# EAGLE design light (EAGLE 8.0.2)
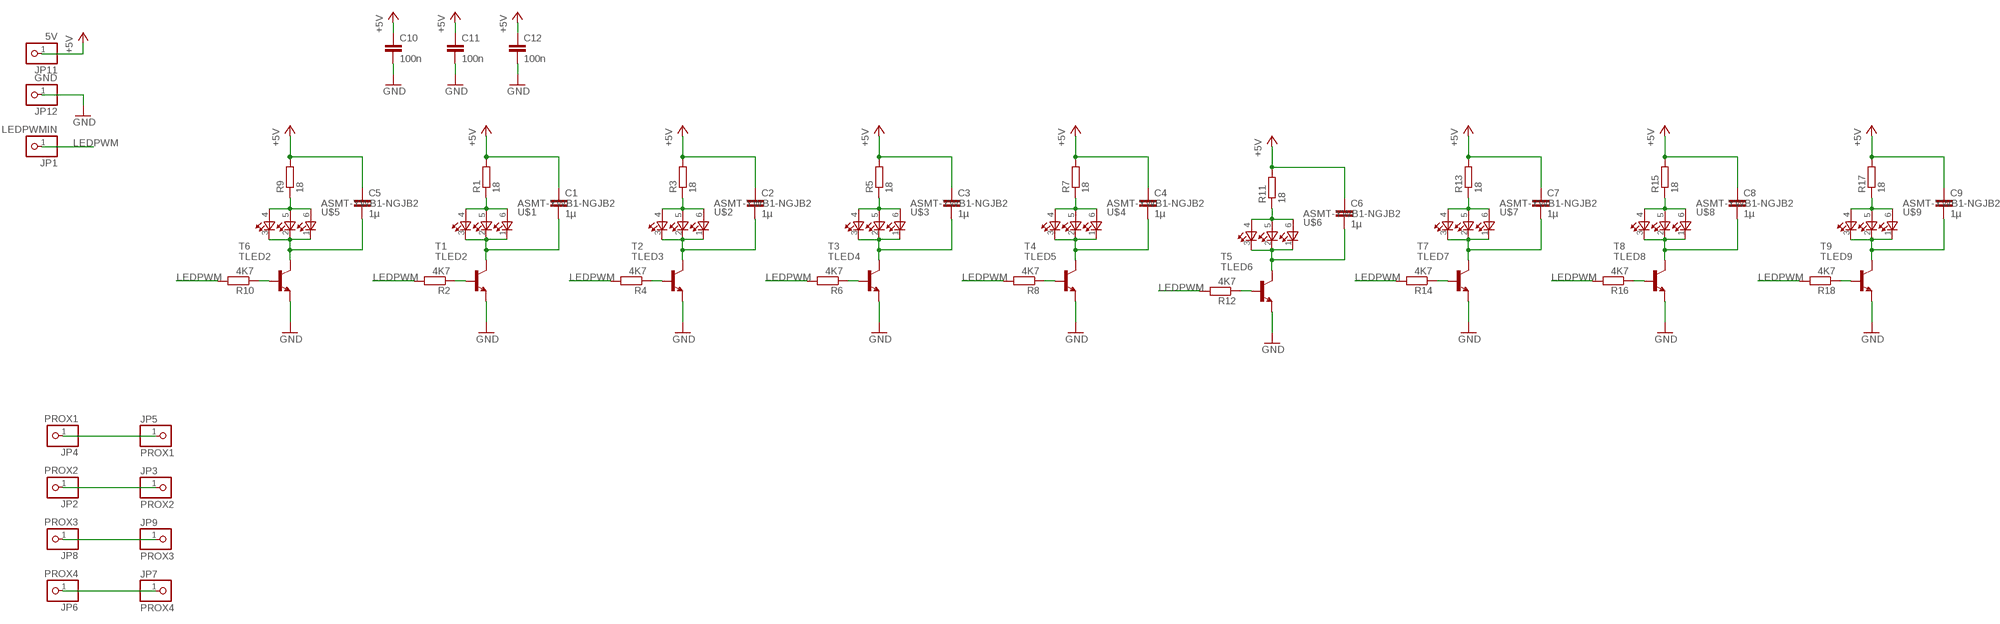
[diagram p0: schematic, sheet 1]

## Parts
C1  1µ  C-EUC0805  [C0805]
C2  1µ  C-EUC0805  [C0805]
C3  1µ  C-EUC0805  [C0805]
C4  1µ  C-EUC0805  [C0805]
C5  1µ  C-EUC0805  [C0805]
C6  1µ  C-EUC0805  [C0805]
C7  1µ  C-EUC0805  [C0805]
C8  1µ  C-EUC0805  [C0805]
C9  1µ  C-EUC0805  [C0805]
C10  100n  C-EUC0805  [C0805]
C11  100n  C-EUC0805  [C0805]
C12  100n  C-EUC0805  [C0805]
JP1  LEDPWMIN  PINHD-1X1  [1X01]
JP2  PROX2  PINHD-1X1  [1X01]
JP3  PROX2  PINHD-1X1  [1X01]
JP4  PROX1  PINHD-1X1  [1X01]
JP5  PROX1  PINHD-1X1  [1X01]
JP6  PROX4  PINHD-1X1  [1X01]
JP7  PROX4  PINHD-1X1  [1X01]
JP8  PROX3  PINHD-1X1  [1X01]
JP9  PROX3  PINHD-1X1  [1X01]
JP11  5V  PINHD-1X1  [1X01]
JP12  GND  PINHD-1X1  [1X01]
R1  18  R-EU_R0805  [R0805]
R2  4K7  R-EU_R0805  [R0805]
R3  18  R-EU_R0805  [R0805]
R4  4K7  R-EU_R0805  [R0805]
R5  18  R-EU_R0805  [R0805]
R6  4K7  R-EU_R0805  [R0805]
R7  18  R-EU_R0805  [R0805]
R8  4K7  R-EU_R0805  [R0805]
R9  18  R-EU_R0805  [R0805]
R10  4K7  R-EU_R0805  [R0805]
R11  18  R-EU_R0805  [R0805]
R12  4K7  R-EU_R0805  [R0805]
R13  18  R-EU_R0805  [R0805]
R14  4K7  R-EU_R0805  [R0805]
R15  18  R-EU_R0805  [R0805]
R16  4K7  R-EU_R0805  [R0805]
R17  18  R-EU_R0805  [R0805]
R18  4K7  R-EU_R0805  [R0805]
T1  TLED2  MMBT3904LT1-NPN-SOT23-BEC  [SOT23-BEC]
T2  TLED3  MMBT3904LT1-NPN-SOT23-BEC  [SOT23-BEC]
T3  TLED4  MMBT3904LT1-NPN-SOT23-BEC  [SOT23-BEC]
T4  TLED5  MMBT3904LT1-NPN-SOT23-BEC  [SOT23-BEC]
T5  TLED6  MMBT3904LT1-NPN-SOT23-BEC  [SOT23-BEC]
T6  TLED2  MMBT3904LT1-NPN-SOT23-BEC  [SOT23-BEC]
T7  TLED7  MMBT3904LT1-NPN-SOT23-BEC  [SOT23-BEC]
T8  TLED8  MMBT3904LT1-NPN-SOT23-BEC  [SOT23-BEC]
T9  TLED9  MMBT3904LT1-NPN-SOT23-BEC  [SOT23-BEC]
U$1  ASMT-YWB1-NGJB2  [ASMT-YWB1-NGJB2]
U$2  ASMT-YWB1-NGJB2  [ASMT-YWB1-NGJB2]
U$3  ASMT-YWB1-NGJB2  [ASMT-YWB1-NGJB2]
U$4  ASMT-YWB1-NGJB2  [ASMT-YWB1-NGJB2]
U$5  ASMT-YWB1-NGJB2  [ASMT-YWB1-NGJB2]
U$6  ASMT-YWB1-NGJB2  [ASMT-YWB1-NGJB2]
U$7  ASMT-YWB1-NGJB2  [ASMT-YWB1-NGJB2]
U$8  ASMT-YWB1-NGJB2  [ASMT-YWB1-NGJB2]
U$9  ASMT-YWB1-NGJB2  [ASMT-YWB1-NGJB2]

## Nets
+5V: C1.1 C2.1 C3.1 C4.1 C5.1 C6.1 C7.1 C8.1 C9.1 C10.1 C11.1 C12.1 JP11.1 R1.2 R3.2 R5.2 R7.2 R9.2 R11.2 R13.2 R15.2 R17.2
BASE2: R12.1 T5.B
BASE3: R14.1 T7.B
BASE4: R16.1 T8.B
BASE5: R18.1 T9.B
COLLECTOR2: C6.2 T5.C U$6.1 U$6.2 U$6.3
COLLECTOR3: C7.2 T7.C U$7.1 U$7.2 U$7.3
COLLECTOR4: C8.2 T8.C U$8.1 U$8.2 U$8.3
COLLECTOR5: C9.2 T9.C U$9.1 U$9.2 U$9.3
GND: C10.2 C11.2 C12.2 JP12.1 T1.E T2.E T3.E T4.E T5.E T6.E T7.E T8.E T9.E
LEDPWM: JP1.1 R2.2 R4.2 R6.2 R8.2 R10.2 R12.2 R14.2 R16.2 R18.2
N$1: R1.1 U$1.4 U$1.5 U$1.6
N$2: C1.2 T1.C U$1.1 U$1.2 U$1.3
N$3: C2.2 T2.C U$2.1 U$2.2 U$2.3
N$4: R3.1 U$2.4 U$2.5 U$2.6
N$5: R2.1 T1.B
N$6: R4.1 T2.B
N$7: C3.2 T3.C U$3.1 U$3.2 U$3.3
N$8: R5.1 U$3.4 U$3.5 U$3.6
N$9: R6.1 T3.B
N$10: C4.2 T4.C U$4.1 U$4.2 U$4.3
N$11: R7.1 U$4.4 U$4.5 U$4.6
N$12: R8.1 T4.B
N$13: R11.1 U$6.4 U$6.5 U$6.6
N$14: C5.2 T6.C U$5.1 U$5.2 U$5.3
N$15: R13.1 U$7.4 U$7.5 U$7.6
N$16: R15.1 U$8.4 U$8.5 U$8.6
N$17: R17.1 U$9.4 U$9.5 U$9.6
N$18: JP2.1 JP3.1
N$19: JP4.1 JP5.1
N$20: JP6.1 JP7.1
N$21: JP8.1 JP9.1
N$22: R9.1 U$5.4 U$5.5 U$5.6
N$23: R10.1 T6.B

## Library data of the parts
C1-C12 = resistor:C-EU: CAPACITOR, European symbol
JP1-JP9 JP11 JP12 = pinhead:PINHD-1X1: PIN HEADER
R1-R18 = resistor:R-EU_: RESISTOR, European symbol
T1-T9 = transistor:*-NPN-: NPN Transistror BF959 corrected 2008.03.06
U$1-U$9 = alarm:ASMT-YWB1-NGJB2

## Board
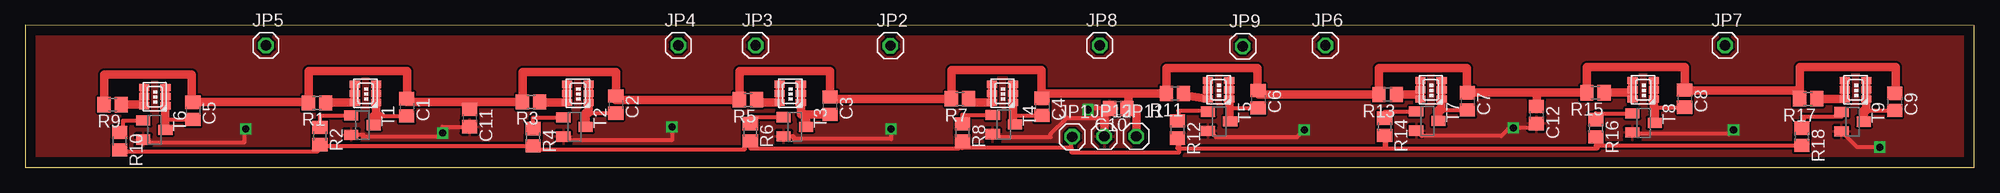
[diagram p1: board, top side]
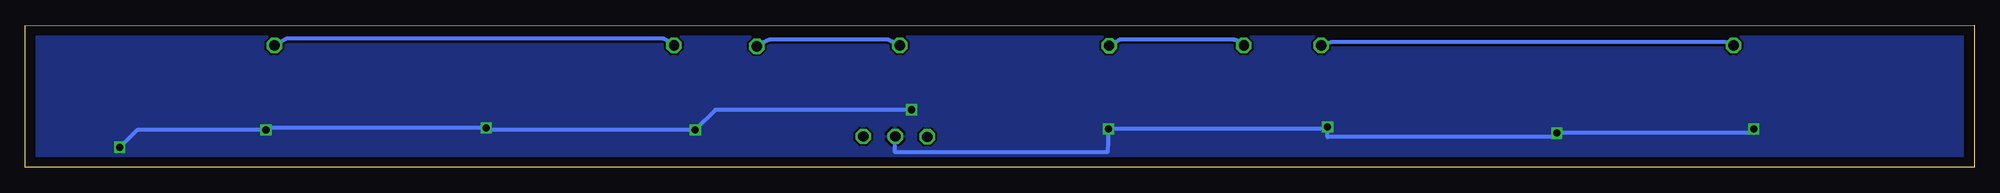
[diagram p2: board, bottom side, seen from below]

Size 192 x 14.04 mm. Coordinates in mm from the lower left corner, seen from the top.
Outline: 0,0 192,0 192,14 0,14.04 0,0
Copper layers (1*16): Top 0.035mm / dielectric 1.5mm / Bottom 0.035mm
Design rules "default": minimum track width 10mil, minimum drill 24mil, track to track 8mil, track to pad 8mil, pad to pad 8mil, via to via 8mil, smd to smd 8mil, copper to edge 40mil, drill to drill 8mil, minimum pad ring 10mil, minimum via ring 8mil, stop-mask expansion 4mil, vias tented up to drill 0mil, thermal gap 10mil

### Footprints (pad centres in the part's own frame; a part is rotated, then mirrored left to right if it is on the bottom)
C0805 = smd 1.3 x 1.5: 1 -0.85,0; 2 0.85,0
1X01 = drill 1.016 octagon: 1 0,0
R0805 = smd 1.3 x 1.5: 1 -0.85,0; 2 0.85,0
SOT23-BEC = smd 1 x 1.4: B -0.95,-1.1; C 0,1.1; E 0.95,-1.1
ASMT-YWB1-NGJB2 = smd 1 x 0.7: 1 2.2,-2.3; 2 2.2,-1.4; 3 2.2,-0.5; 4 0.1,-0.5; 5 0.1,-1.4; 6 0.1,-2.3

### Placement (x,y rotation side)
C1  37.57,5.94 270 top
C2  58.17,6.22 270 top
C3  79.27,6.1 270 top
C4  100.17,5.98 270 top
C5  16.5,5.6 270 top
C6  121.47,6.74 270 top
C7  142.07,6.52 270 top
C8  163.47,6.8 270 top
C9  184.17,6.48 270 top
C10  107.68,5.83 180 top
C11  43.77,4.88 270 top
C12  148.87,5.18 270 top
JP1  103.15,3.03 0 top
JP2  85.23,12.03 0 top
JP3  71.95,12.05 0 top
JP4  64.33,12.05 0 top
JP5  23.71,12.05 0 top
JP6  128.09,12.05 0 top
JP7  167.47,12.05 0 top
JP8  105.85,12.05 0 top
JP9  119.95,11.97 0 top
JP11  109.45,3.07 0 top
JP12  106.3,3.07 0 top
R1  28.74,6.38 180 top
R2  29.02,3.11 270 top
R3  49.82,6.48 180 top
R4  50.02,2.99 270 top
R5  71.2,6.68 180 top
R6  71.42,3.47 270 top
R7  92.08,6.78 180 top
R8  92.32,3.45 270 top
R9  8.6,6.2 180 top
R10  9.3,2.6 270 top
R11  113.26,7.3 180 top
R12  113.5,3.74 270 top
R13  134.22,7.2 180 top
R14  133.92,4.01 270 top
R15  154.69,7.38 180 top
R16  154.72,3.87 270 top
R17  175.65,6.78 180 top
R18  175.02,3.03 270 top
T1  33.21,4.18 270 top
T2  54.11,4 270 top
T3  75.81,4.02 270 top
T4  96.41,4.24 270 top
T5  117.61,4.56 270 top
T6  12.7,3.7 270 top
T7  138.13,4.58 270 top
T8  159.43,4.4 270 top
T9  180.03,4.52 270 top
U$1  32.36,8.72 0 top
U$2  53.28,8.72 0 top
U$3  74.2,8.72 0 top
U$4  95.12,8.72 0 top
U$5  11.6,8.4 0 top
U$6  116.41,9.07 0 top
U$7  137.33,9.07 0 top
U$8  158.25,9.07 0 top
U$9  179.17,9.07 0 top

### Tracks (layer width: path | path; a pad name or v marks a point on that pad's centre or on a via)
+5V
  Top 0.406: 16.4,6.55 arc90 C5.1 | 27.89,6.45 R1.2 | 37.6,6.79 C1.1 37.57,6.48 | 58.2,7.07 C2.1 58.17,6.68 | 79.3,6.95 C3.1 79.27,6.78 | 100.1,6.83 C4.1 100.17,7.3 | 108.7,5.83 C10.1 108.53,7.3 | 121.4,7.59 C6.1 121.47,7.2 | 142,7.37 C7.1 142.07,7.4 | 148.9,6.03 C12.1 | 148.9,7.4 148.9,7.38 | 163.5,7.65 C8.1 163.47,7.6 | 174.7,7.6 174.7,6.78 R17.2 | 184.3,7.33 C9.1
  Top 0.813: 16.4,6.55 16.4,9.2 7.75,9.2 R9.2 | C5.1 27.89,6.45 | R1.2 27.89,9.5 37.6,9.5 37.6,6.79 | 43.77,6.48 37.57,6.48 | 43.77,6.48 R3.2 48.97,9.4 58.2,9.4 58.2,7.07 | C11.1 43.77,6.48 | 58.17,6.68 R5.2 70.35,9.5 79.3,9.5 79.3,6.95 | 79.27,6.78 R7.2 91.23,9.6 100.1,9.6 100.1,6.83 | 100.17,7.3 108.53,7.3 108.7,7.3 | 108.7,7.3 108.7,5.83 | 108.7,7.3 R11.2 112.41,9.8 121.4,9.8 121.4,7.59 | JP11.1 109.45,5.83 C10.1 | 121.47,7.2 R13.2 133.37,9.8 142,9.8 142,7.37 | 142.07,7.4 148.9,7.4 148.9,6.03 | 148.9,7.38 R15.2 153.84,9.9 163.5,9.9 163.5,7.65 | 163.47,7.6 174.7,7.6 | R17.2 174.8,9.9 184.3,9.9 184.3,7.33
BASE2
  Top 0.406: T5.B 116.51,5.6 113.6,5.6 113.6,4.59 R12.1
BASE3
  Top 0.406: R14.1 133.92,5.53 T7.B
BASE4
  Top 0.406: R16.1 154.72,5.35 T8.B
BASE5
  Top 0.406: T9.B 178.93,5 175.2,5 175.1,3.88 R18.1
COLLECTOR2
  Top 0.406: 118.61,5.89 C6.2 | 118.61,4.56 T5.C
  Top 0.813: U$6.3 U$6.2 U$6.1 118.61,5.89 118.61,4.56
COLLECTOR3
  Top 0.406: C7.2 139.53,5.67 139.23,5.67
  Top 0.813: U$7.3 U$7.2 U$7.1 139.53,5.67 | T7.C 139.23,5.67
COLLECTOR4
  Top 0.406: C8.2 160.45,5.95 160.53,5.95
  Top 0.813: U$8.3 U$8.2 U$8.1 160.45,5.95 | T8.C 160.53,5.95
COLLECTOR5
  Top 0.406: C9.2 181.37,5.63 181.13,5.63
  Top 0.813: U$9.3 U$9.2 U$9.1 181.37,5.63 | T9.C 181.13,5.63
GND  (via drill 0.7)
  Top 0.406: 106.3,5.6 106.83,5.6 C10.2 104.83,5.83 v104.7,5.7 | 106.3,2.77 JP12.1 | T6.E 11.6,2.5 21.6,2.5 21.6,3.8 v21.7,3.8 | T1.E 33.3,3.23 33.3,3 41.1,3 v41.1,3.4 41.1,4.03 C11.2 | v63.7,4 63.7,2.7 53.6,2.7 53.6,3.05 T2.E | v85.3,3.8 85.3,2.8 75.7,2.8 75.7,3.07 T3.E | T4.E 95.31,3 101,3 101,3.3 102.6,4.9 106.2,4.9 106.3,5 | T5.E 116.69,3.61 117.3,3 125.3,3 v126,3.7 | C12.2 148.44,3.9 v146.6,3.9 146.2,3.9 145.4,3.1 137.56,3.1 T7.E | v168.3,3.7 168.2,3.7 167.8,3.3 158.48,3.3 T8.E | v182.7,2 180.5,2 T9.E
  Top 0.813: 106.3,5.6 106.3,5 106.3,2.77
  Bottom 0.406: v21.7,3.8 21.7,3.4 v41.1,3.4 41.1,3 63.7,3 v63.7,4 63.7,3.8 v85.3,3.8 85.4,1.5 106.3,1.5 JP12.1 | v104.7,5.7 124,5.7 v126,3.7 | v126,3.7 126.1,3.6 | v126,3.7 146.4,3.7 v146.6,3.9 168.1,3.9 v168.3,3.7 181,3.7 v182.7,2
  pour Top: 0,0 0,14 192,14 192,0
  pour Bottom: 0,0 0,14 192,14 192,0
LEDPWM
  Top 0.406: R10.2 9.3,1.6 28.8,1.6 28.8,2.26 R2.2 29.02,2.14 R4.2 50.02,1.8 70.9,1.8 70.9,2.62 R6.2 71.42,1.9 92,1.9 92,2.6 R8.2 | R8.2 92.32,1.93 | 103.05,2 JP1.1 | 103.05,2 103.05,1.5 113.7,1.5 113.7,2.89 R12.2 113.5,1.9 134.1,1.9 134.1,3.16 R14.2 133.92,1.9 154.9,1.9 154.9,3.02 R16.2 154.72,2.18 R18.2 | R8.2 92.32,2 103.05,2
N$1
  Top 0.406: 29.59,6.42 R1.1
  Top 0.813: U$1.4 U$1.5 U$1.6 29.59,6.42
N$2
  Top 0.406: C1.2 34.9,5.09 34.56,5.09
  Top 0.813: U$1.3 U$1.2 U$1.1 34.56,5.09 | T1.C 34.31,5.09 34.9,5.09
N$3
  Top 0.406: C2.2 55.48,5.37 55.21,5.37
  Top 0.813: U$2.3 U$2.2 U$2.1 55.48,5.37 | T2.C 55.21,5.37
N$4
  Top 0.406: R3.1 50.67,6.42
  Top 0.813: 50.67,6.42 U$2.6 U$2.5 U$2.4
N$5
  Top 0.406: R2.1 29.02,5.13 T1.B
N$6
  Top 0.406: T2.B 53.01,4.9 50,4.9 50,3.84 R4.1
N$7
  Top 0.406: 76.91,5.25 76.8,5.25
  Top 0.813: U$3.3 U$3.2 U$3.1 76.4,5.25 76.8,5.25 C3.2 | T3.C 76.91,5.25
N$8
  Top 0.406: R5.1 72.05,6.42
  Top 0.813: 72.05,6.42 U$3.6 U$3.5 U$3.4
N$9
  Top 0.406: R6.1 71.42,4.97 T3.B
N$10
  Top 0.406: 97.32,5.13 C4.2 | T4.C 97.32,4.24
  Top 0.813: U$4.3 U$4.2 U$4.1 97.32,5.13 97.32,4.24
N$11
  Top 0.406: R7.1 92.93,6.42
  Top 0.813: 92.93,6.42 U$4.6 U$4.5 U$4.4
N$12
  Top 0.406: R8.1 92.32,5.19 T4.B
N$13
  Top 0.406: R11.1 114.11,7.17
  Top 0.813: 114.11,7.17 U$6.6 U$6.5 U$6.4
N$14
  Top 0.406: 13.8,4.75 C5.2
  Top 0.813: U$5.3 U$5.2 U$5.1 13.8,4.75 T6.C
N$15
  Top 0.406: U$7.5 U$7.6
  Top 0.813: U$7.4 U$7.5 | U$7.6 137.43,7.2 R13.1
N$16
  Top 0.406: U$8.5 158.35,7.38
  Top 0.813: U$8.4 U$8.5 U$8.6 | 158.35,7.38 R15.1
N$17
  Top 0.406: U$9.6
  Top 0.813: U$9.4 U$9.5 U$9.6 | U$9.6 R17.1
N$18
  Bottom 0.406: JP3.1 71.95,12.35 72.9,12.6 84.16,12.6 JP2.1
N$19
  Bottom 0.406: JP5.1 23.71,12.21 24.6,12.4 63.28,12.4 JP4.1
N$20
  Bottom 0.406: JP6.1 128.09,12.19 129.1,12.7 166.32,12.7 JP7.1
N$21
  Bottom 0.406: JP8.1 107,12.6 118.72,12.6 JP9.1
N$22
  Top 0.406: 11.7,6.2 U$5.6
  Top 0.813: R9.1 11.7,6.2 | U$5.6 U$5.5 U$5.4
N$23
  Top 0.406: 9.3,3.75 R10.1 9.6,3.45 9.6,4.6 11.6,4.6 T6.B